# Altium project betrusted-kbd-braille4.PrjPcb
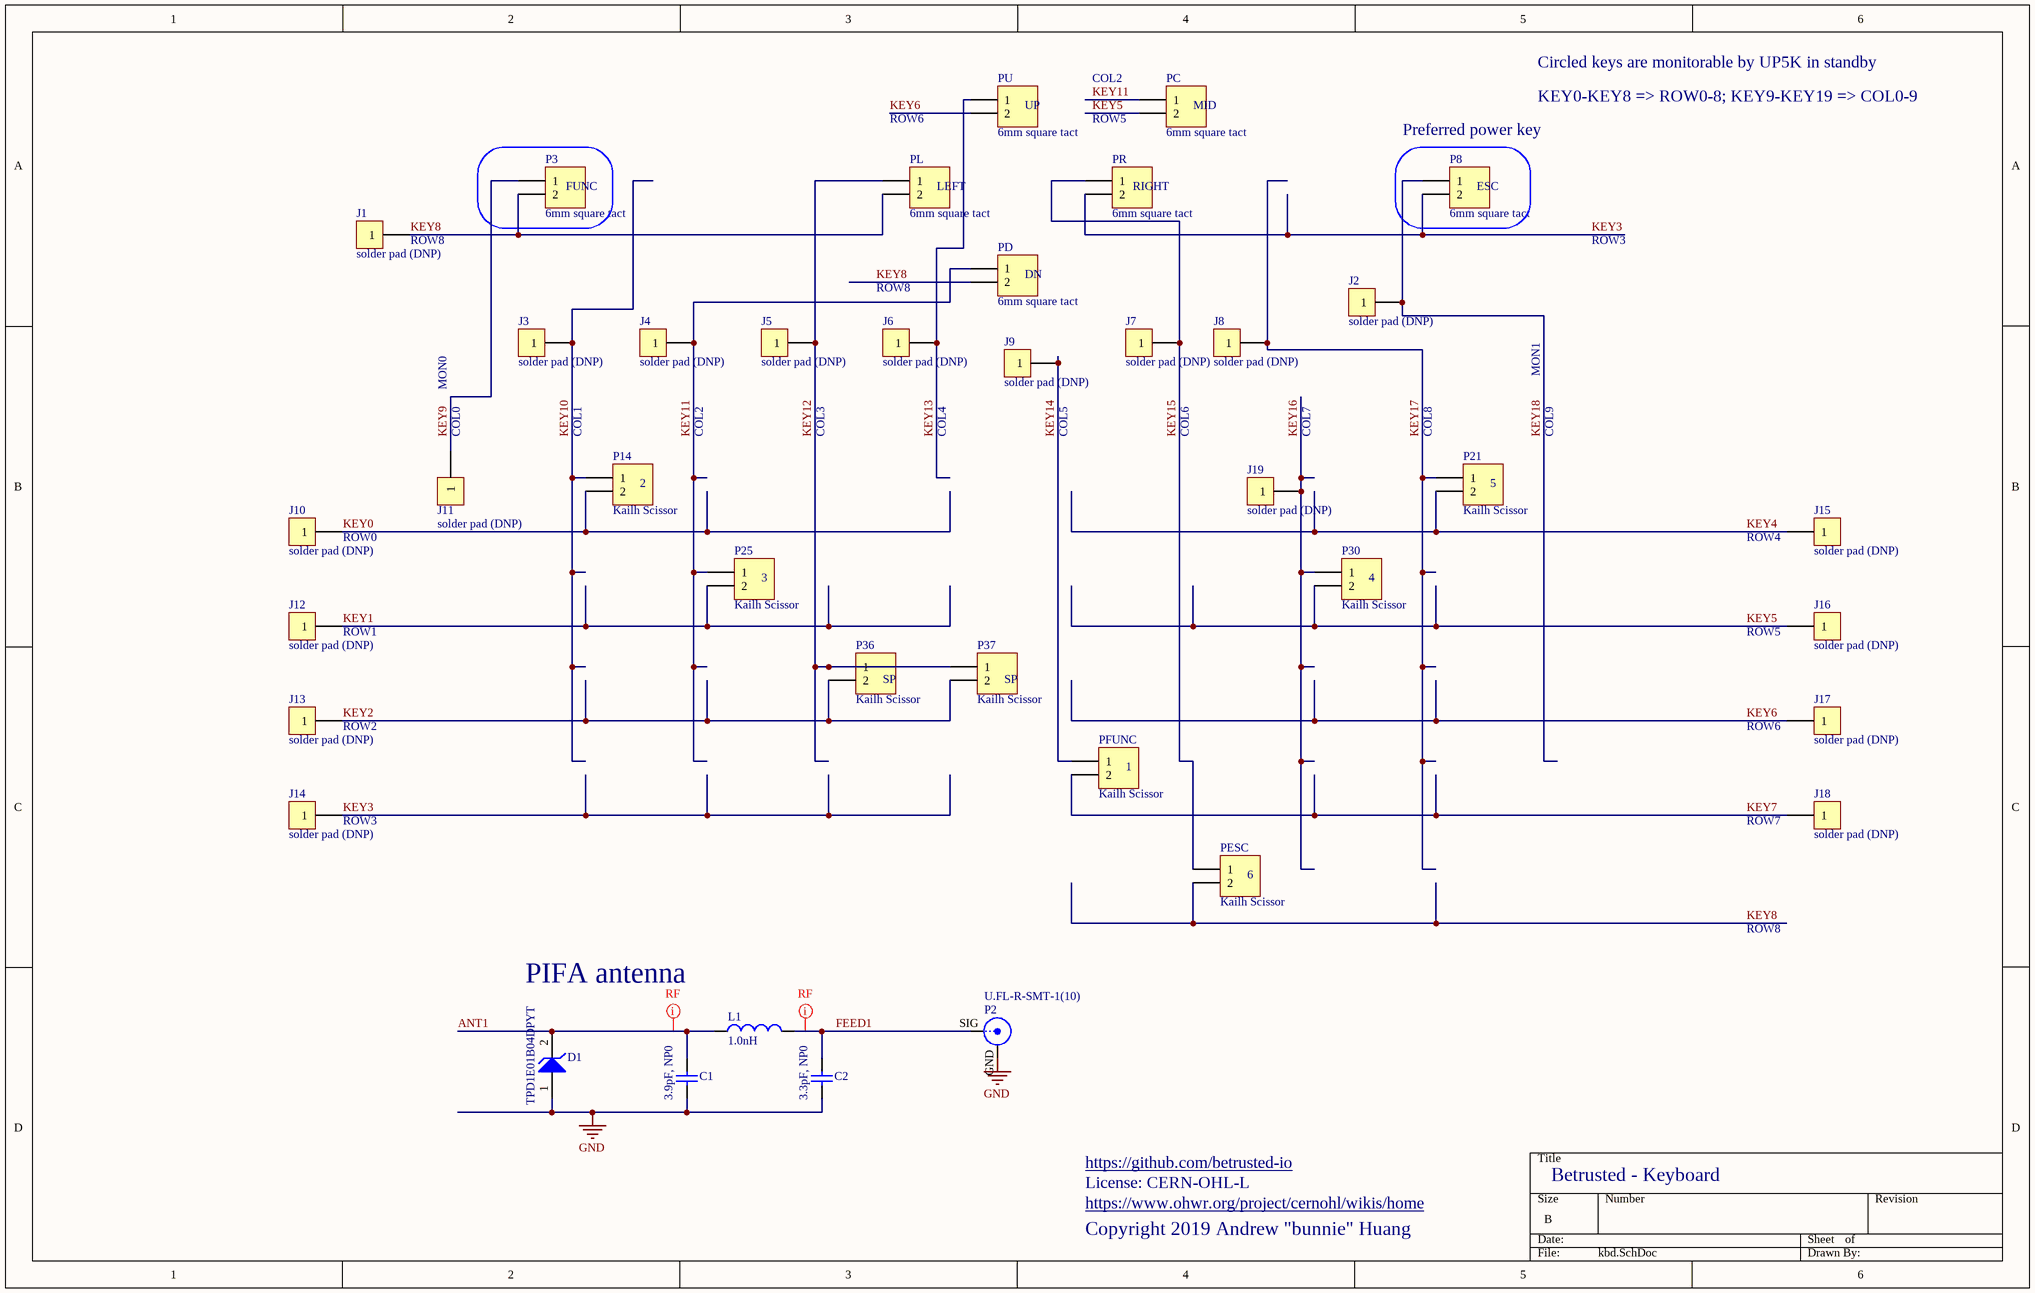
[diagram p0: kbd.SchDoc]
1 sheet, 39 parts. Net scope: global (net labels, ports and power ports of the same name join across sheets).
Board file: bt-bezel-braille4-kailh.PcbDoc

## Sheet kbd.SchDoc
size B

### Parts
C1  3.9pF, NP0  [B_CAP0402]
C2  3.3pF, NP0  [B_CAP0402]
D1  TPD1E01B04DPYT  [TI_PX1SON-N2]
J1  solder pad (DNP)  [TP_1.5x1.5_SMT]
J2  solder pad (DNP)  [TP_1.5x1.5_SMT]
J3  solder pad (DNP)  [TP_1.5x1.5_SMT]
J4  solder pad (DNP)  [TP_1.5x1.5_SMT]
J5  solder pad (DNP)  [TP_1.5x1.5_SMT]
J6  solder pad (DNP)  [TP_1.5x1.5_SMT]
J7  solder pad (DNP)  [TP_1.5x1.5_SMT]
J8  solder pad (DNP)  [TP_1.5x1.5_SMT]
J9  solder pad (DNP)  [TP_1.5x1.5_SMT]
J10  solder pad (DNP)  [TP_1.5x1.5_SMT]
J11  solder pad (DNP)  [TP_1.5x1.5_SMT]
J12  solder pad (DNP)  [TP_1.5x1.5_SMT]
J13  solder pad (DNP)  [TP_1.5x1.5_SMT]
J14  solder pad (DNP)  [TP_1.5x1.5_SMT]
J15  solder pad (DNP)  [TP_1.5x1.5_SMT]
J16  solder pad (DNP)  [TP_1.5x1.5_SMT]
J17  solder pad (DNP)  [TP_1.5x1.5_SMT]
J18  solder pad (DNP)  [TP_1.5x1.5_SMT]
J19  solder pad (DNP)  [TP_1.5x1.5_SMT]
L1  1.0nH  [B_IND0402]
P2  U.FL-R-SMT-1(10)  [HRS_U.FL]
P3  6mm square tact  [PANASONIC_EVPAS]
P8  6mm square tact  [PANASONIC_EVPAS]
P14  Kailh Scissor  [KAILH_CPG142501D03]
P21  Kailh Scissor  [KAILH_CPG142501D03]
P25  Kailh Scissor  [KAILH_CPG142501D03]
P30  Kailh Scissor  [KAILH_CPG142501D03]
P36  Kailh Scissor  [KAILH_CPG142501D03]
P37  Kailh Scissor  [KAILH_CPG142501D03]
PC  6mm square tact  [PANASONIC_EVPAS]
PD  6mm square tact  [PANASONIC_EVPAS]
PESC  Kailh Scissor  [KAILH_CPG142501D03]
PFUNC  Kailh Scissor  [KAILH_CPG142501D03]
PL  6mm square tact  [PANASONIC_EVPAS]
PR  6mm square tact  [PANASONIC_EVPAS]
PU  6mm square tact  [PANASONIC_EVPAS]

### Blocks framed on the sheet
FUNC: P3
Preferred power key: P8

### Nets
GND: C1.2 C2.2 D1.1(A) P2.GND(Y)
ANT1: C1.1 D1.2(K) L1.1
FEED1: C2.1 L1.2 P2.SIG(X)
KEY0: J10.1 P14.2
KEY1: J12.1 P25.2
KEY2: J13.1 P36.2 P37.2
KEY3: J14.1 P8.2 PR.2
KEY4: J15.1 P21.2
KEY5: J16.1 P30.2 PC.2
KEY6: J17.1 PU.2
KEY7: J18.1 PFUNC.2
KEY8: J1.1 P3.2 PD.2 PESC.2 PL.2
KEY9: J11.1 P3.1
KEY10: J3.1 P14.1
KEY11: J4.1 P25.1 PC.1 PD.1
KEY12: J5.1 P36.1 P37.1 PL.1
KEY13: J6.1 PU.1
KEY14: J9.1 PFUNC.1
KEY15: J7.1 PESC.1 PR.1
KEY16: J19.1 P30.1
KEY17: J8.1 P21.1
KEY18: J2.1 P8.1

### Layout directives
net class RF: ANT1, FEED1

### Notes on the sheet
- (near PC) COL2
- Circled keys are monitorable by UP5K in standby
- KEY0-KEY8 => ROW0-8; KEY9-KEY19 => COL0-9
- ROW6
- (near PU) UP
- ROW5
- (near PC) MID
- (near PL) LEFT
- (near PR) RIGHT
- (near P8) ESC
- (near J1) ROW8
- (near J6) ROW8
- (near PD) DN
- ROW3
- MON1
- MON0
- (near J11) COL0
- COL1
- COL2
- COL3
- COL4
- COL5
- COL6
- COL7
- (near P21) COL8
- COL9
- (near P14) 2
- (near P21) 5
- (near J10) ROW0
- (near J15) ROW4
- (near J12) ROW1
- (near P25) 3
- (near P30) 4
- (near J16) ROW5
- (near P36) SP
- (near P37) SP
- (near J13) ROW2
- (near PFUNC) 1
- (near J17) ROW6
- (near J14) ROW3
- (near J18) ROW7
- (near PESC) 6
- ROW8
- PIFA antenna
- https://github.com/betrusted-io
- Betrusted - Keyboard
- Copyright 2019 Andrew "bunnie" Huang
- https://www.ohwr.org/project/cernohl/wikis/home
- License: CERN-OHL-L

### Library data of the parts
C1 = Cap Semi: Capacitor (Semiconductor SIM Model); MPN: CL05C3R9CB5NNNC; VENDOR: Samsung; MYPN: C-3p9-50-NP0-0402
C2 = Cap Semi: Capacitor (Semiconductor SIM Model); MPN: GRM1555C1H3R3CA01D; VENDOR: Murata; MYPN: C-3p3-50-NP0-0402
D1 = D Zener: CPDUR24V; VENDOR: TI; MYPN: D-TPD1E01B04DPYT; Published: 8-Jun-2000; LatestRevisionDate: 17-Jul-2002; LatestRevisionNote: Re-released for DXP Platform.; PackageReference: DIODE-0.7; Publisher: Altium Limited; PackageDescription: Diode, Thru-Hole; 2 Leads; 0.7 in Pin Spacing; MPN: TPD1E01B04DPYT
J1-J19 = CON1: Connector; MYPN: J-TP-PWRTAP-0603; MPN: DNP; VENDOR: DNP
L1 = Inductor: MPN: LQG15HS1N0S02D; Code_IEC: 1005; VENDOR: Murata; MYPN: L-1p0NH-0402; Published: 8-Jun-2000; LatestRevisionDate: 29-May-2009; LatestRevisionNote: IPC-7351 Footprint Added.; PackageReference: 0402-A; Publisher: Altium Limited; PackageDescription: Chip Inductor; Code_JEITA: 0402
P2 = BNC: BNC Elbow Connector; MPN: P1163-0140R; VENDOR: Kaweei; MYPN: J-U.FL-SMT; LatestRevisionDate: 17-Jul-2002; LatestRevisionNote: Re-released for DXP Platform.; Publisher: Altium Limited
P3 P8 PC PD PL PR PU = Header 2: Header, 2-Pin; MPN: EVP-ASAC1A; VENDOR: Panasonic; MYPN: SW-EVQ-P6DB35; LatestRevisionDate: 17-Jul-2002; LatestRevisionNote: Re-released for DXP Platform.; Publisher: Altium Limited
P14 P21 P25 P30 P36 P37 PESC PFUNC = Header 2: Header, 2-Pin; MPN: CPG142501D03; MYPN: SW-EVQ-P6DB35; LatestRevisionDate: 17-Jul-2002; LatestRevisionNote: Re-released for DXP Platform.; Publisher: Altium Limited; VENDOR: Kailh